# EasyEDA Pro project Charger Splitter.eprj, schematic Schematic4
Board Name: Board4; Create Date: 2025-09-04; Page Name: P1; Project Name: Charger Splitter; Schematic Name: Schematic4; Update Date: 2025-09-14; Company: EasyEDA.com; Page Size: A4; Version: V1.0
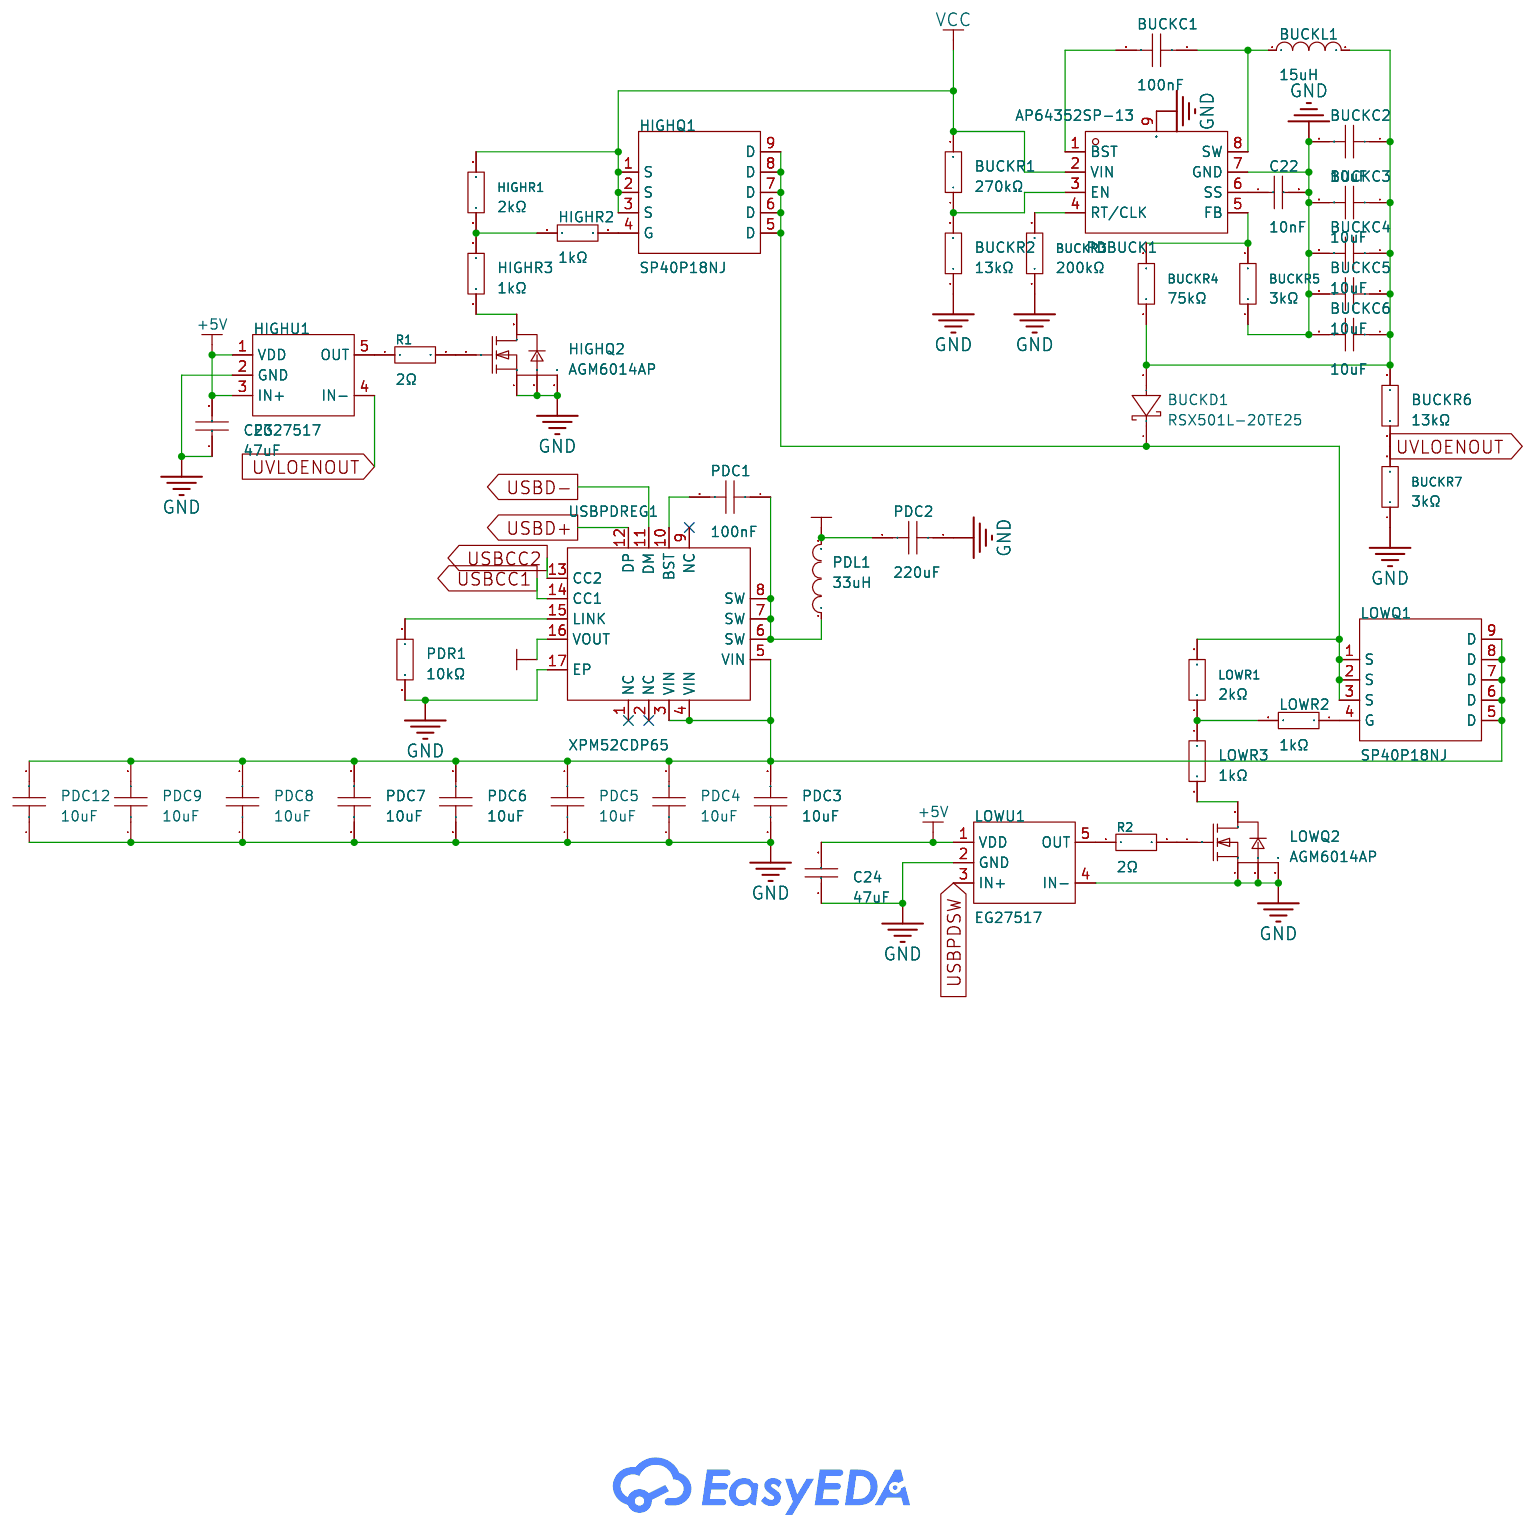
[diagram p4: schematic sheet]

## Parts
BUCKC1  100nF  [C0805]
BUCKC2  10uF  [C0805]
BUCKC3  10uF  [C0805]
BUCKC4  10uF  [C0805]
BUCKC5  10uF  [C0805]
BUCKC6  10uF  [C0805]
BUCKD1  RSX501L-20TE25  [SMA_L4.5-W2.6-LS5.0-RD]
BUCKL1  15uH  [IND-SMD_L13.7-W12.6_MS1360]
BUCKR1  270kΩ  [R0805]
BUCKR2  13kΩ  [R0805]
BUCKR3  200kΩ  [R0805]
BUCKR4  75kΩ  [R0603]
BUCKR5  3kΩ  [R0805]
BUCKR6  13kΩ  [R0805]
BUCKR7  3kΩ  [R0805]
C22  10nF  [C0805]
C23  47uF  [C0805]
C24  47uF  [C0805]
HIGHQ1  SP40P18NJ  [DFN-8_L3.0-W3.0-P0.65-BL-EP_PE5G6EA]
HIGHQ2  AGM6014AP  [PDFN-8_L3.1-W3.0-P0.65-LS3.3-BL]
HIGHR1  2kΩ  [R0805]
HIGHR2  1kΩ  [R0805]
HIGHR3  1kΩ  [R0805]
HIGHU1  EG27517  [SOT-23-5_L2.9-W1.6-P0.95-LS2.8-BR]
LOWQ1  SP40P18NJ  [DFN-8_L3.0-W3.0-P0.65-BL-EP_PE5G6EA]
LOWQ2  AGM6014AP  [PDFN-8_L3.1-W3.0-P0.65-LS3.3-BL]
LOWR1  2kΩ  [R0805]
LOWR2  1kΩ  [R0805]
LOWR3  1kΩ  [R0805]
LOWU1  EG27517  [SOT-23-5_L2.9-W1.6-P0.95-LS2.8-BR]
PDBUCK1  AP64352SP-13  [SO-8_L4.9-W3.9-P1.27-LS6.0-BL-EP]
PDC1  100nF  [C0805]
PDC2  220uF  [C1206]
PDC3  10uF  [C0805]
PDC4  10uF  [C0805]
PDC5  10uF  [C0805]
PDC6  10uF  [C0805]
PDC7  10uF  [C0805]
PDC8  10uF  [C0805]
PDC9  10uF  [C0805]
PDC12  10uF  [C0805]
PDL1  33uH  [IND-SMD_L13.5-W12.5]
PDR1  10kΩ  [R0805]
R1  2Ω  [R0603]
R2  2Ω  [R0603]
USBPDREG1  XPM52CDP65  [QFN-16_L4.0-W4.0-P0.65-TL-EP2.3]

## Library data of the parts
BUCKC1 PDC1 = CC0805KRX7R9BB104: Capacitance: Tolerance:±10% Tolerance:±10% Voltage Rated: Temperature Coefficient:; LCSC Part Name: 100nF ±10% 50V; Supplier Part: C49678; Manufacturer: YAGEO(国巨); Supplier Footprint: 0805; JLCPCB Part Class: Basic Part; Datasheet: https://atta.szlcsc.com/upload/public/pdf/source/20180224/C181747_15194369449651363981.pdf; Supplier: LCSC; Tolerance: ±10%
BUCKC2-BUCKC6 PDC3-PDC9 PDC12 = GRM21BR61H106KE43L: LCSC Part Name: 10uF ±10% 50V; Supplier Part: C440198; Manufacturer: muRata(村田); Supplier Footprint: 0805; JLCPCB Part Class: Basic Part; Datasheet: https://atta.szlcsc.com/upload/public/pdf/source/20230811/95AAE0C9AF55EDC31B7A4D8B733F534E.pdf; Supplier: LCSC; Tolerance: ±10%
BUCKD1 = RSX501L-20TE25: Diode Configuration:Independent Voltage - Forward(Vf@If):390mV@3A Voltage - DC Reverse(Vr):20V Current - Rectified:5A Reverse Leakage Current (Ir):500uA@20V Non-Repetitive Peak Forward Surge Current:70A; LCSC Part Name: 电压:20V 电流:5A; Supplier Part: C329921; Manufacturer: ROHM(罗姆); Supplier Footprint: SMA; JLCPCB Part Class: Extended Part; Datasheet: https://item.szlcsc.com/datasheet/RSX501L-20TE25/309630.html; Supplier: LCSC; Diode Configuration: Independent; Voltage - Forward(Vf@If): 390mV@3A; Voltage - DC Reverse(Vr): 20V; Current - Rectified: 5A; Reverse Leakage Current (Ir): 500uA@20V; Non-Repetitive Peak Forward Surge Current: 70A
BUCKL1 = FCH1365-150M: Inductance: Tolerance:±20% Tolerance:±20% Rated Current: Saturation Current (Isat):12A DC Resistance (DCR): Type:Integrated molded inductor; LCSC Part Name: 15uH ±20% 12A; Supplier Part: C20415554; Manufacturer: FC(方成); Supplier Footprint: SMD,13.7x12.8mm; JLCPCB Part Class: Extended Part; Datasheet: https://atta.szlcsc.com/upload/public/pdf/source/20240103/3CA526AF9C9EA27CDB3ABCA223075033.pdf; Supplier: LCSC; Tolerance: ±20%; Saturation Current (Isat): 12A; Type: Integrated molded inductor
BUCKR1 = 0805W8F2703T5E: LCSC Part Name: 270kΩ ±1% 125mW 厚膜电阻; Supplier Part: C17589; Manufacturer: UNI-ROYAL(厚声); Supplier Footprint: 0805; JLCPCB Part Class: Extended Part; Datasheet: https://atta.szlcsc.com/upload/public/pdf/source/20200306/C422600_1E6D84923E4A46A82E41ADD87F860B5C.pdf; Supplier: LCSC; Type: Thick Film Resistors; Tolerance: ±1%; Temperature Coefficient: ±100ppm/℃; Operating Temperature Range: -55℃~+155℃
BUCKR2 BUCKR6 = 0805W8F1302T5E: Type:Thick Film Resistors Resistance:13kΩ Tolerance:±1% Tolerance:±1% Power(Watts): Overload Voltage (Max): Temperature Coefficient:±100ppm/℃ Temperature Coefficient:±100ppm/℃ Operating Temperature Range:-55℃~+155℃ Operating Temperature Range:-55℃~+155℃; LCSC Part Name: 13kΩ ±1% 125mW 厚膜电阻; Supplier Part: C17455; Manufacturer: UNI-ROYAL(厚声); Supplier Footprint: 0805; JLCPCB Part Class: Extended Part; Datasheet: https://atta.szlcsc.com/upload/public/pdf/source/20200306/C422600_1E6D84923E4A46A82E41ADD87F860B5C.pdf; Supplier: LCSC; Type: Thick Film Resistors; Tolerance: ±1%; Temperature Coefficient: ±100ppm/℃; Operating Temperature Range: -55℃~+155℃
BUCKR3 = 0805W8F2003T5E: Type:Thick Film Resistors Resistance:200kΩ Tolerance:±1% Tolerance:±1% Power(Watts): Overload Voltage (Max): Temperature Coefficient:±100ppm/℃ Temperature Coefficient:±100ppm/℃ Operating Temperature Range:-55℃~+155℃ Operating Temperature Range:-55℃~+155℃; LCSC Part Name: 200kΩ ±1% 125mW 厚膜电阻; Supplier Part: C17539; Manufacturer: UNI-ROYAL(厚声); Supplier Footprint: 0805; JLCPCB Part Class: Basic Part; Datasheet: https://atta.szlcsc.com/upload/public/pdf/source/20200306/C422600_1E6D84923E4A46A82E41ADD87F860B5C.pdf; Supplier: LCSC; Type: Thick Film Resistors; Tolerance: ±1%; Temperature Coefficient: ±100ppm/℃; Operating Temperature Range: -55℃~+155℃
BUCKR4 = 0603WAF7502T5E: LCSC Part Name: 75kΩ ±1% 100mW 厚膜电阻; Supplier Part: C23242; Manufacturer: UNI-ROYAL(厚声); Supplier Footprint: 0603; JLCPCB Part Class: Basic Part; Datasheet: https://item.szlcsc.com/datasheet/0603WAF7502T5E/23969.html; Supplier: LCSC; Type: Thick Film Resistor; Tolerance: ±1%; Power(Watts): 100mW; Voltage-Supply(Max): 75V; Temperature Coefficient: ±100ppm/℃; Operating Temperature: -55℃~+155℃
BUCKR5 BUCKR7 = 0805W8F3001T5E: Type:Thick Film Resistor Resistance:3kΩ Tolerance:±1% Tolerance:±1% Power(Watts):125mW Voltage-Supply(Max):150V Temperature Coefficient:±100ppm/℃ Temperature Coefficient:±100ppm/℃ Operating Temperature:-55℃~+155℃ Operating Temperature:-55℃~+155℃; LCSC Part Name: 3kΩ ±1% 125mW 厚膜电阻; Supplier Part: C17661; Manufacturer: UNI-ROYAL(厚声); Supplier Footprint: 0805; JLCPCB Part Class: Basic Part; Datasheet: https://item.szlcsc.com/datasheet/0805W8F3001T5E/18349.html; Supplier: LCSC; Type: Thick Film Resistor; Tolerance: ±1%; Power(Watts): 125mW; Voltage-Supply(Max): 150V; Temperature Coefficient: ±100ppm/℃; Operating Temperature: -55℃~+155℃
C22 = CL21B103KBANNNC: Capacitance:10nF Tolerance:±10% Tolerance:±10% Voltage Rating:50V Temperature Coefficient:X7R; LCSC Part Name: 10nF ±10% 50V; Supplier Part: C1710; Manufacturer: SAMSUNG(三星); Supplier Footprint: 0805; JLCPCB Part Class: Basic Part; Datasheet: https://item.szlcsc.com/datasheet/CL21B103KBANNNC/2062.html; Supplier: LCSC; Tolerance: ±10%; Voltage Rating: 50V; Temperature Coefficient: X7R
C23 C24 = CL21A476MQYNNNE: LCSC Part Name: 47uF ±20% 6.3V; Supplier Part: C16780; Manufacturer: SAMSUNG(三星); Supplier Footprint: 0805; JLCPCB Part Class: Basic Part; Datasheet: https://item.szlcsc.com/datasheet/CL21A476MQYNNNE/17464.html; Supplier: LCSC; Tolerance: ±20%; Voltage Rating: 6.3V; Temperature Coefficient: X5R
HIGHQ1 LOWQ1 = SP40P18NJ: LCSC Part Name: 中低压P型MOSFET 1个P沟道 耐压:40V 电流:20A; Supplier Part: C41355197; Manufacturer: Siliup(矽普); Supplier Footprint: PDFNWB-8L(3.3x3.3); JLCPCB Part Class: Extended Part; Datasheet: https://item.szlcsc.com/datasheet/SP40P18NJ/43089524.html; Supplier: LCSC; Number: 1 P-Channel; Drain to Source Voltage: 40V; Current - Continuous Drain(Id): 20A; RDS(on): 18mΩ@10V；25mΩ@4.5V; Pd - Power Dissipation: 35W; Gate Threshold Voltage (Vgs(th)): 1.7V@250uA; Gate Charge(Qg): 24nC@10V; Input Capacitance(Ciss): 1.75nF; Reverse Transfer Capacitance (Crss@Vds): 180pF; Operating Temperature: -55℃~+150℃; Type: P-Channel; Output Capacitance(Coss): 215pF
HIGHQ2 LOWQ2 = AGM6014AP: Number:1 N-Channel Drain to Source Voltage:60V Current - Continuous Drain(Id):72A RDS(on):4.3mΩ@10V Pd - Power Dissipation:54W Gate Threshold Voltage (Vgs(th)):1.6V@250uA Gate Charge(Qg):33nC@10V Input Capacitance(Ciss):1.524nF Reverse Transfer Capacitanc; LCSC Part Name: 1个N沟道 耐压:60V 电流:72A; Supplier Part: C6719405; Manufacturer: AGM-Semi(芯控源); Supplier Footprint: PDFN-8(3.3x3.3); JLCPCB Part Class: Extended Part; Datasheet: https://item.szlcsc.com/datasheet/AGM6014AP/7677118.html; Supplier: LCSC; Number: 1 N-Channel; Drain to Source Voltage: 60V; Current - Continuous Drain(Id): 72A; RDS(on): 4.3mΩ@10V; Pd - Power Dissipation: 54W; Gate Threshold Voltage (Vgs(th)): 1.6V@250uA; Gate Charge(Qg): 33nC@10V; Input Capacitance(Ciss): 1.524nF; Reverse Transfer Capacitance (Crss@Vds): 31pF; Operating Temperature: -55℃~+150℃; Output Capacitance(Coss): 631pF
HIGHR1 LOWR1 = 0805W8F2001T5E: LCSC Part Name: 2kΩ ±1% 125mW 厚膜电阻; Supplier Part: C17604; Manufacturer: UNI-ROYAL(厚声); Supplier Footprint: 0805; JLCPCB Part Class: Basic Part; Datasheet: https://atta.szlcsc.com/upload/public/pdf/source/20200306/C422600_1E6D84923E4A46A82E41ADD87F860B5C.pdf; Supplier: LCSC; Type: Thick Film Resistors; Tolerance: ±1%; Temperature Coefficient: ±100ppm/℃; Operating Temperature Range: -55℃~+155℃
HIGHR2 HIGHR3 LOWR2 LOWR3 = 0805W8F1001T5E: LCSC Part Name: 1kΩ ±1% 125mW 厚膜电阻; Supplier Part: C17513; Manufacturer: UNI-ROYAL(厚声); Supplier Footprint: 0805; JLCPCB Part Class: Basic Part; Datasheet: https://atta.szlcsc.com/upload/public/pdf/source/20200306/C422600_1E6D84923E4A46A82E41ADD87F860B5C.pdf; Supplier: LCSC; Type: Thick Film Resistors; Tolerance: ±1%; Temperature Coefficient: ±100ppm/℃; Operating Temperature Range: -55℃~+155℃
HIGHU1 LOWU1 = EG27517: Driven Configuration:Low Side Load Type:MOSFET；IGBT Number of Drivers:1 Current - Output Low(IOL):4A Current - Output High(IOH):4A Voltage - Supply:4V~20V Voltage - Supply:4V~20V Rise Time:40ns Fall Time:20ns Operating Temperature:-45℃~+125℃ Operating Tem; LCSC Part Name: 高速低侧单通道驱动芯片; Supplier Part: C2987449; Manufacturer: EG(屹晶微); Supplier Footprint: SOT-23-5; JLCPCB Part Class: Extended Part; Datasheet: https://item.szlcsc.com/datasheet/EG27517/3440336.html; Supplier: LCSC; Driven Configuration: Low Side; Load Type: MOSFET；IGBT; Number of Drivers: 1; Current - Output Low(IOL): 4A; Current - Output High(IOH): 4A; Voltage - Supply: 4V~20V; Rise Time: 40ns; Fall Time: 20ns; Operating Temperature: -45℃~+125℃; Input Logic Level - Low: -300mV~1V; Quiescent Current(Iq): 10uA
PDBUCK1 = AP64352SP-13: Function:Step-down type Output Type:- Voltage - Supply:3.8V~40V Voltage - Supply:3.8V~40V Output Voltage:- Output Voltage:- Output Current:3.5A Frequency - Switching:100kHz~2.2MHz Frequency - Switching:100kHz~2.2MHz Operating Temperature:-40℃~+85℃ Operati; LCSC Part Name: 3.8V至40V输入，3.5A低静态电流同步降压转换器; Supplier Part: C2071665; Manufacturer: DIODES(美台); Supplier Footprint: SO-8-EP; JLCPCB Part Class: Extended Part; Datasheet: https://atta.szlcsc.com/upload/public/pdf/source/20211207/6E33FF1B3B23FC2994BFD67B246A4BA4.pdf; Supplier: LCSC; Function: Step-down type; Voltage - Supply: 3.8V~40V; Output Current: 3.5A; Frequency - Switching: 100kHz~2.2MHz; Operating Temperature: -40℃~+85℃; Synchronous Rectifier: Yes; Number of Outputs: 1; Topology: Step-down; Switch tube (built-in/external): Built-in
PDC2 = GRM31CR60J227ME11L: Capacitance: Tolerance:±20% Tolerance:±20% Voltage Rated: Temperature Coefficient:; LCSC Part Name: 220uF ±20% 6.3V; Supplier Part: C412252; Manufacturer: muRata(村田); Supplier Footprint: 1206; JLCPCB Part Class: Extended Part; Datasheet: https://atta.szlcsc.com/upload/public/pdf/source/20190904/C426118_85E81C7C1F21FC87C5FB6D536E0847B4.pdf; Supplier: LCSC; Tolerance: ±20%
PDL1 = TMPC1265HP-330MG-D: Inductance:33uH Tolerance:±20% Tolerance:±20% Current Rating:8A Current - Saturation(Isat):11A DC Resistance(DCR):58mΩ Ratings:-; LCSC Part Name: 33uH ±20% 11A; Supplier Part: C2880059; Manufacturer: TAI-TECH(台庆); Supplier Footprint: SMD,13.5x12.5x6.2mm; JLCPCB Part Class: Extended Part; Datasheet: https://atta.szlcsc.com/upload/public/pdf/source/20200917/C357273_E96B0D9948E86B50B5288E147C270664.pdf; Supplier: LCSC; Tolerance: ±20%; Current Rating: 8A; Current - Saturation(Isat): 11A; DC Resistance(DCR): 58mΩ
PDR1 = 0805W8F1002T5E: Type:Thick Film Resistor Resistance:10kΩ Tolerance:±1% Tolerance:±1% Power(Watts):125mW Voltage-Supply(Max):150V Temperature Coefficient:±100ppm/℃ Temperature Coefficient:±100ppm/℃ Operating Temperature:-55℃~+155℃ Operating Temperature:-55℃~+155℃; LCSC Part Name: 10kΩ ±1% 125mW 厚膜电阻; Supplier Part: C17414; Manufacturer: UNI-ROYAL(厚声); Supplier Footprint: 0805; JLCPCB Part Class: Basic Part; Datasheet: https://item.szlcsc.com/datasheet/0805W8F1002T5E/18102.html; Supplier: LCSC; Type: Thick Film Resistor; Tolerance: ±1%; Power(Watts): 125mW; Voltage-Supply(Max): 150V; Temperature Coefficient: ±100ppm/℃; Operating Temperature: -55℃~+155℃
R1 R2 = 0603WAF200KT5E: LCSC Part Name: 2Ω ±1% 100mW 厚膜电阻; Supplier Part: C22977; Manufacturer: UNI-ROYAL(厚声); Supplier Footprint: 0603; JLCPCB Part Class: Basic Part; Datasheet: https://item.szlcsc.com/datasheet/0603WAF200KT5E/23704.html; Supplier: LCSC; Type: Thick Film Resistor; Tolerance: ±1%; Power(Watts): 100mW; Voltage-Supply(Max): 75V; Temperature Coefficient: ±200ppm/℃; Operating Temperature: -55℃~+155℃
USBPDREG1 = XPM52CDP65: Supplier Part: C42460907; Manufacturer: FM(富满); Supplier Footprint: QFN-16-EP(4x4); JLCPCB Part Class: Extended Part; Datasheet: https://item.szlcsc.com/datasheet/XPM52CDP65/44547237.html; Supplier: LCSC

## Nets
+5V: C23.2 C24.2 HIGHU1.1(VDD) HIGHU1.3(IN+) LOWU1.1(VDD)
GND: BUCKC2.2 BUCKC3.2 BUCKC4.2 BUCKC5.2 BUCKC6.2 BUCKR2.1 BUCKR3.1 BUCKR5.1 BUCKR7.1 C22.2 C23.1 C24.1 HIGHQ2.1(S) HIGHQ2.2(S) HIGHQ2.3(S) HIGHU1.2(GND) LOWQ2.1(S) LOWQ2.2(S) LOWQ2.3(S) LOWU1.2(GND) LOWU1.4(IN-) PDBUCK1.7(GND) PDBUCK1.9(PAD) PDC2.1 PDC3.1 PDC4.1 PDC5.1 PDC6.1 PDC7.1 PDC8.1 PDC9.1 PDC12.1 PDR1.2 USBPDREG1.17(EP)
VCC: BUCKR1.2 HIGHQ1.1(S) HIGHQ1.2(S) HIGHQ1.3(S) HIGHR1.2 PDBUCK1.2(VIN)
USBCC1: USBPDREG1.14(CC1)
USBCC2: USBPDREG1.13(CC2)
USBD+: USBPDREG1.12(DP)
USBD-: USBPDREG1.11(DM)
USBPD: PDC2.2 PDL1.2 USBPDREG1.16(VOUT)
USBPDSW: LOWU1.3(IN+)
UVLOENOUT: BUCKR6.1 BUCKR7.2 HIGHU1.4(IN-)
$1N1848: LOWQ1.5(D) LOWQ1.6(D) LOWQ1.7(D) LOWQ1.8(D) LOWQ1.9(D) PDC3.2 PDC4.2 PDC5.2 PDC6.2 PDC7.2 PDC8.2 PDC9.2 PDC12.2 USBPDREG1.3(VIN) USBPDREG1.4(VIN) USBPDREG1.5(VIN)
$1N1850: PDC1.1 PDL1.1 USBPDREG1.6(SW) USBPDREG1.7(SW) USBPDREG1.8(SW)
$1N1852: PDC1.2 USBPDREG1.10(BST)
$1N1856: PDR1.1 USBPDREG1.15(LINK)
$1N1863: BUCKR1.1 BUCKR2.2 PDBUCK1.3(EN)
$1N1864: BUCKC1.1 BUCKL1.1 PDBUCK1.8(SW)
$1N1867: BUCKR3.2 PDBUCK1.4(RT/CLK)
$1N1868: BUCKR4.2 BUCKR5.2 PDBUCK1.5(FB)
$1N1870: C22.1 PDBUCK1.6(SS)
$1N1871: BUCKC2.1 BUCKC3.1 BUCKC4.1 BUCKC5.1 BUCKC6.1 BUCKD1.2(K) BUCKL1.2 BUCKR4.1 BUCKR6.2
$1N7478: LOWR1.1 LOWR2.2 LOWR3.1
$1N7609: HIGHR1.1 HIGHR2.2 HIGHR3.2
$1N9286: HIGHQ2.4(G) R1.2
$1N9327: HIGHU1.5(OUT) R1.1
$1N9376: LOWQ2.4(G) R2.2
$1N9380: LOWU1.5(OUT) R2.1
$1N10648: BUCKD1.1(A) HIGHQ1.5(D) HIGHQ1.6(D) HIGHQ1.7(D) HIGHQ1.8(D) HIGHQ1.9(D) LOWQ1.1(S) LOWQ1.2(S) LOWQ1.3(S) LOWR1.2
$1N10681: BUCKC1.2 PDBUCK1.1(BST)
$1N14039: HIGHQ1.4(G) HIGHR2.1
$1N14155: LOWQ1.4(G) LOWR2.1
Net-(HIGHQ2-5): HIGHQ2.5(D) HIGHR3.1
Net-(LOWQ2-5): LOWQ2.5(D) LOWR3.2

Not connected (* = marked no-connect by the designer): USBPDREG1 1(NC)* 2(NC)* 9(NC)*
